# EAGLE schematic balenceCharger (EAGLE 7.5.0)
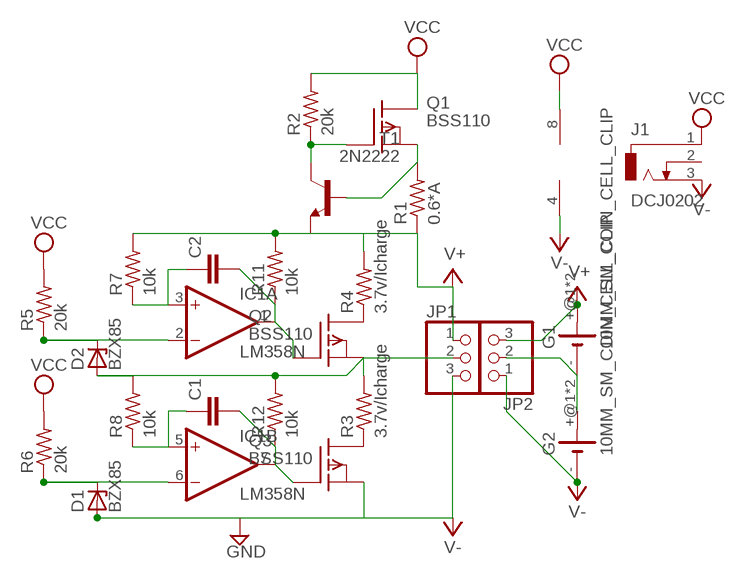
[diagram p0: schematic, sheet 1]

## Parts
C1  C-EU025-060X050  [C025-060X050]
C2  C-EU025-060X050  [C025-060X050]
D1  BZX85  [DO41Z10]
D2  BZX85  [DO41Z10]
G1  10MM_SM_COIN_CELL_CLIP  [10MM_SM_COIN_CELL_CLIP]
G2  10MM_SM_COIN_CELL_CLIP  [10MM_SM_COIN_CELL_CLIP]
IC1  LM358N  [DIL08]
J1  DCJ0202  [DCJ0202]
JP1  PINHD-1X3/90  [1X03/90]
JP2  PINHD-1X3/90  [1X03/90]
Q1  BSS110  [TO92]
Q2  BSS110  [TO92]
Q3  BSS110  [TO92]
R1  0.6*A  R-US_0204/5  [0204/5]
R2  20k  R-US_0204/5  [0204/5]
R3  3.7v/Icharge  R-US_0411/3V  [0411V]
R4  3.7v/Icharge  R-US_0411/3V  [0411V]
R5  20k  R-US_0204/5  [0204/5]
R6  20k  R-US_0204/5  [0204/5]
R7  10k  R-US_0204/5  [0204/5]
R8  10k  R-US_0204/5  [0204/5]
R11  10k  R-US_0204/5  [0204/5]
R12  10k  R-US_0204/5  [0204/5]
T1  2N2222  [TO18]

## Nets
GND: D1.A JP1.3 Q3.1(S) ; supply symbol labelled V-
N$1: Q1.2(G) R2.1 T1.3(C)
N$3: Q1.1(S) R1.2 T1.2(B)
N$4: Q3.3(D) R3.1
N$5: D2.A JP1.2 Q2.1(S) R3.2 R8.2 R12.2
N$6: Q2.3(D) R4.1
N$7: D2.C IC1.2(A:-IN) R5.1
N$8: D1.C IC1.6(B:-IN) R6.1
N$9: C2.1 IC1.3(A:+IN) R7.1
N$10: G1.- G2.+@1(+) G2.+@2(+) JP2.2
N$11: C1.1 IC1.5(B:+IN) R8.1
N$12: C1.2 IC1.7(B:OUT) Q3.2(G) R12.1
N$13: C2.2 IC1.1(A:OUT) Q2.2(G) R11.1
V+: G1.+@1(+) G1.+@2(+) JP1.1 JP2.3 R1.1 R4.2 R7.2 R11.2 T1.1(E)
V-: G2.- IC1.4(P:V-) J1.3 JP2.1
VCC: IC1.8(P:V+) J1.1 Q1.3(D) R2.2 R5.2 R6.2
Unconnected: J1.2

## Library data of the parts
C1 C2 = rcl:C-EU: CAPACITOR, European symbol
D1 D2 = diode:BZX85: Z DIODE
G1 G2 = battery:10MM_SM_COIN_CELL_CLIP: Battery cell clip for CR927 Source: KEYSTONE ELECTRONICS CORP. www.keyelco.com, ASTORIA, N.Y. 11105-2017 PART ANME 10mm SM COIN CELl CLIP DWG NO. 3030
IC1 = linear:LM358: OP AMP also LM158; LM258; LM2904 Source: http://cache.national.com/ds/LM/LM158.pdf
J1 = con-jack:DCJ0202: DC POWER JACK Source: DCJ0202.pdf; OC_FARNELL: unknown; OC_NEWARK: unknown
JP1 JP2 = pinhead:PINHD-1X3: PIN HEADER
Q1-Q3 = transistor-fet:BSS110: P-Channel Enhancement MOSFET -50V; -0,17A; 6Ohm
R1-R8 R11 R12 = rcl:R-US_: RESISTOR, American symbol
T1 = transistor:2N2222: NPN TRANSISTOR